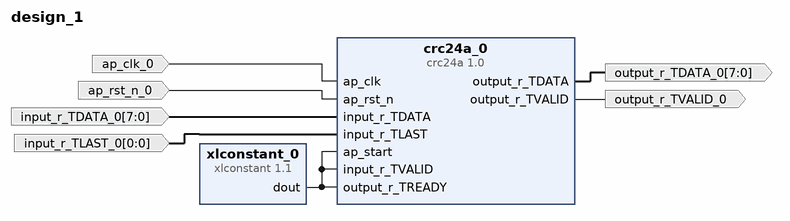
[diagram p0: block diagram of the top level]
# Vivado block design design_1, xczu7ev-ffvc1156-2-e, Vivado 2022.2.2
create_bd_design design_1

create_bd_port -dir I -type clk ap_clk_0
create_bd_port -dir I -type rst ap_rst_n_0
create_bd_port -dir I -from 7 -to 0 input_r_TDATA_0
create_bd_port -dir O -from 7 -to 0 output_r_TDATA_0
create_bd_port -dir O output_r_TVALID_0
create_bd_port -dir I -from 0 -to 0 input_r_TLAST_0

create_bd_cell -type ip -vlnv xilinx.com:ip:xlconstant:1.1 xlconstant_0
create_bd_cell -type ip -vlnv xilinx.com:hls:crc24a:1.0 crc24a_0

# ---- connections ----

connect_bd_net -net ap_clk_0_1 [get_bd_ports ap_clk_0] [get_bd_pins crc24a_0/ap_clk]
connect_bd_net -net ap_rst_n_0_1 [get_bd_ports ap_rst_n_0] [get_bd_pins crc24a_0/ap_rst_n]
connect_bd_net [get_bd_pins crc24a_0/output_r_TDATA] [get_bd_ports output_r_TDATA_0]
connect_bd_net [get_bd_pins crc24a_0/output_r_TVALID] [get_bd_ports output_r_TVALID_0]
connect_bd_net -net input_r_TDATA_0_1 [get_bd_ports input_r_TDATA_0] [get_bd_pins crc24a_0/input_r_TDATA]
connect_bd_net -net input_r_TLAST_0_1 [get_bd_ports input_r_TLAST_0] [get_bd_pins crc24a_0/input_r_TLAST]
connect_bd_net [get_bd_pins xlconstant_0/dout] \
  [get_bd_pins crc24a_0/ap_start] [get_bd_pins crc24a_0/input_r_TVALID] [get_bd_pins crc24a_0/output_r_TREADY]

validate_bd_design
save_bd_design
